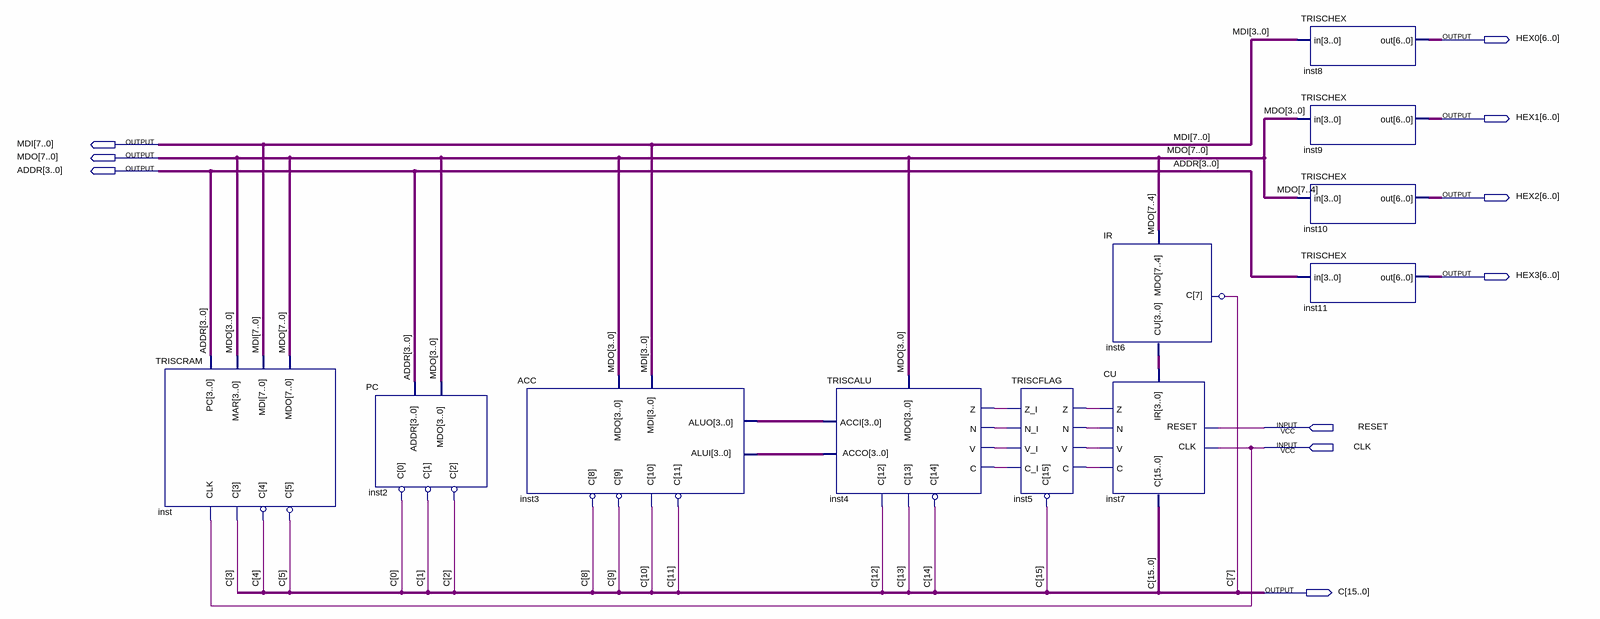
[diagram p0: schematic sheet]
// Quartus schematic TRISCPROCESSOR.bdf as structural Verilog: 11 symbols, 10 pins
module TRISCPROCESSOR (
  input  RESET,
  input  CLK,
  output [6:0] HEX0,
  output [6:0] HEX1,
  output [7:0] MDI,
  output [7:0] MDO,
  output [3:0] ADDR,
  output [6:0] HEX2,
  output [6:0] HEX3,
  output [15:0] C
);

  wire inst4_c, inst4_n, inst4_v, inst4_z, inst5_c, inst5_n, inst5_v, inst5_z;
  wire [3:0] inst3_aluo, inst4_acco, inst6_cu;

  TRISCRAM inst (.CLK(CLK), .C(C[5:3]), .MAR(MDO[3:0]), .MDI(MDI), .PC(ADDR), .MDO(MDO));
  PC inst2 (.C(C[2:0]), .MDO(MDO[3:0]), .ADDR(ADDR));
  ACC inst3 (.ALUI(inst4_acco), .C(C[11:8]), .MDO(MDO[3:0]), .ALUO(inst3_aluo), .MDI(MDI[3:0]));
  TRISCALU inst4 (
    .ACCI(inst3_aluo), .C({C[14:12], inst4_c}), .MDO(MDO[3:0]), .ACCO(inst4_acco), .N(inst4_n), .V(inst4_v),
    .Z(inst4_z));
  TRISCFLAG inst5 (
    .C({C[15], inst5_c}), .C_I(inst4_c), .N_I(inst4_n), .V_I(inst4_v), .Z_I(inst4_z), .N(inst5_n),
    .V(inst5_v), .Z(inst5_z));
  IR inst6 (.C(~C[7]), .MDO(MDO[7:4]), .CU(inst6_cu));
  CU inst7 (
    .RESET(RESET), .CLK(CLK), .Z(inst5_z), .N(inst5_n), .V(inst5_v), .C({C[15:1], inst5_c, C[0]}),
    .IR(inst6_cu));
  TRISCHEX inst8 (.in(MDI[3:0]), .out(HEX0));
  TRISCHEX inst9 (.in(MDO[3:0]), .out(HEX1));
  TRISCHEX inst10 (.in(MDO[7:4]), .out(HEX2));
  TRISCHEX inst11 (.in(ADDR), .out(HEX3));
endmodule
